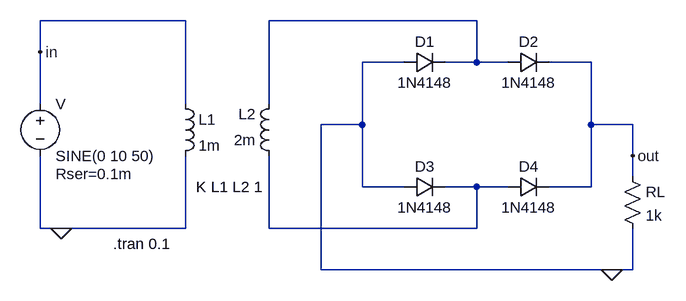
[diagram p0: schematic 3-fw.asc]
3-fw.asc, the LTspice schematic file:
Version 4.1
SHEET 1 880 680
WIRE -96 -32 -320 -32
WIRE 352 -32 32 -32
WIRE -320 16 -320 -32
WIRE 240 32 176 32
WIRE 352 32 352 -32
WIRE 352 32 304 32
WIRE 400 32 352 32
WIRE 528 32 464 32
WIRE -320 96 -320 16
WIRE -96 96 -96 -32
WIRE 32 96 32 -32
WIRE 176 128 176 32
WIRE 176 128 112 128
WIRE 528 128 528 32
WIRE 592 128 528 128
WIRE 592 176 592 128
WIRE 592 208 592 176
WIRE 176 224 176 128
WIRE 240 224 176 224
WIRE 352 224 304 224
WIRE 400 224 352 224
WIRE 528 224 528 128
WIRE 528 224 464 224
WIRE -320 288 -320 176
WIRE -288 288 -320 288
WIRE -96 288 -96 176
WIRE -96 288 -288 288
WIRE 32 288 32 176
WIRE 352 288 352 224
WIRE 352 288 32 288
WIRE 112 352 112 128
WIRE 560 352 112 352
WIRE 592 352 592 288
WIRE 592 352 560 352
FLAG 592 176 out
FLAG 560 352 0
FLAG -288 288 0
FLAG -320 16 in
SYMBOL voltage -320 80 R0
WINDOW 123 0 0 Left 0
WINDOW 39 24 124 Left 2
SYMATTR SpiceLine Rser=0.1m
SYMATTR InstName V
SYMATTR Value SINE(0 10 50)
SYMBOL diode 240 48 R270
WINDOW 0 32 32 VTop 2
WINDOW 3 0 32 VBottom 2
SYMATTR InstName D1
SYMATTR Value 1N4148
SYMBOL diode 400 48 R270
WINDOW 0 32 32 VTop 2
WINDOW 3 0 32 VBottom 2
SYMATTR InstName D2
SYMATTR Value 1N4148
SYMBOL diode 240 240 R270
WINDOW 0 32 32 VTop 2
WINDOW 3 0 32 VBottom 2
SYMATTR InstName D3
SYMATTR Value 1N4148
SYMBOL diode 400 240 R270
WINDOW 0 32 32 VTop 2
WINDOW 3 0 32 VBottom 2
SYMATTR InstName D4
SYMATTR Value 1N4148
SYMBOL res 576 192 R0
SYMATTR InstName RL
SYMATTR Value 1k
SYMBOL ind -112 80 R0
SYMATTR InstName L1
SYMATTR Value 1m
SYMATTR Type ind
SYMBOL ind 48 192 R180
WINDOW 0 36 80 Left 2
WINDOW 3 36 40 Left 2
SYMATTR InstName L2
SYMATTR Value 2m
SYMATTR Type ind
TEXT -80 224 Left 2 !K L1 L2 1
TEXT -208 312 Left 2 !.tran 0.1

The netlist it stands for:
* 3-fw.asc
V in 0 SINE(0 10 50) Rser=0.1m
D1 0 N001 1N4148
D2 N001 out 1N4148
D3 0 N002 1N4148
D4 N002 out 1N4148
RL out 0 1k
L1 in 0 1m
L2 N002 N001 2m
.model D D
.lib standard.dio
K L1 L2 1
.tran 0.1
.backanno
.end